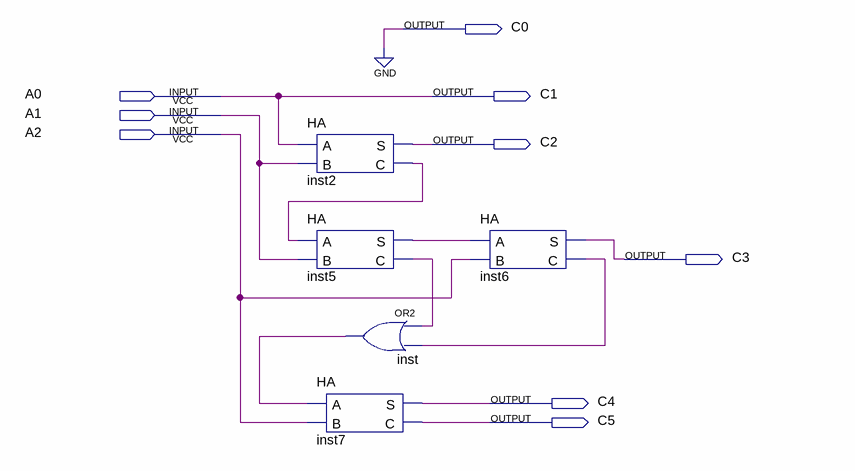
[diagram p0: schematic sheet]
// Quartus schematic Question2.bdf as structural Verilog: 5 symbols, 9 pins
module Question2 (
  input  A0,
  input  A1,
  input  A2,
  output C0,
  output C1,
  output C2,
  output C3,
  output C4,
  output C5
);

  wire inst2_c, inst5_c, inst5_s, inst6_c, inst_out;

  HA inst2 (.A(A0), .B(A1), .S(C2), .C(inst2_c));
  HA inst5 (.A(inst2_c), .B(A1), .S(inst5_s), .C(inst5_c));
  HA inst7 (.A(inst_out), .B(A2), .S(C4), .C(C5));
  or inst (inst_out, inst5_c, inst6_c);
  HA inst6 (.A(inst5_s), .B(A2), .S(C3), .C(inst6_c));

  assign C0 = 1'b0;
  assign C1 = A0;
endmodule
